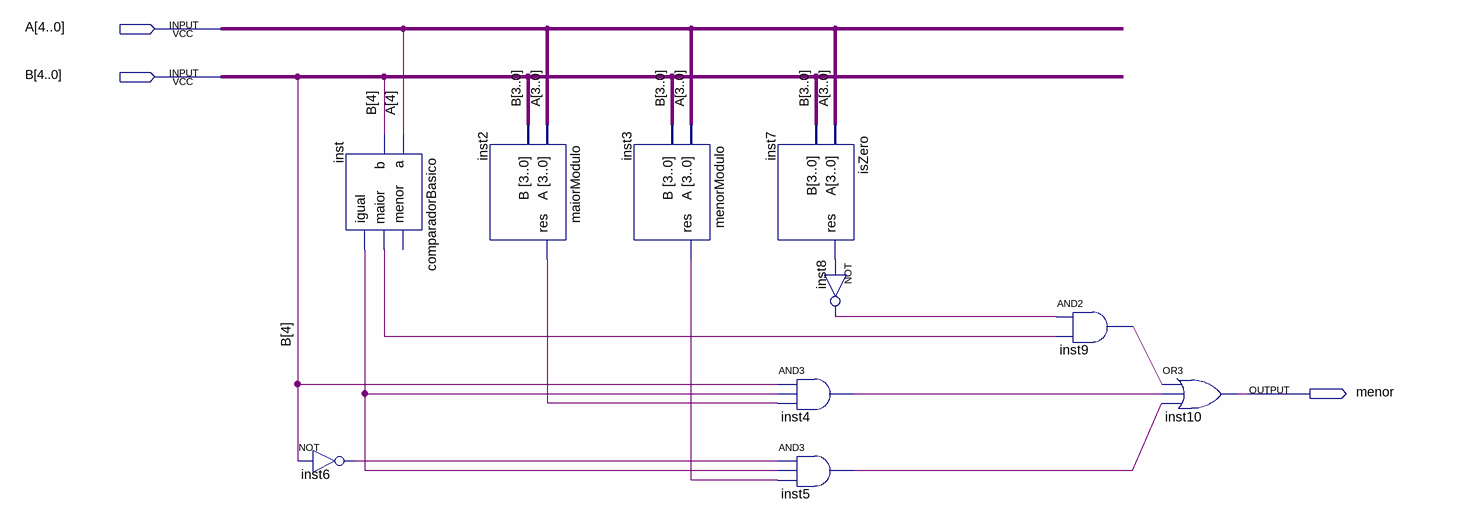
[diagram p0: schematic sheet]
// Quartus schematic menor.bdf as structural Verilog: 10 symbols, 3 pins
module menor (
  input  [4:0] A,
  input  [4:0] B,
  output menor
);

  wire inst2_res, inst3_res, inst4_out, inst5_out, inst6_out, inst7_res, inst8_out, inst9_out, inst_igual,
       inst_maior;

  not inst6 (inst6_out, B[4]);
  comparadorBasico inst (.a(A[4]), .b(B[4]), .maior(inst_maior), .igual(inst_igual));  // open: menor
  maiorModulo inst2 (.A(A[3:0]), .B(B[3:0]), .res(inst2_res));
  menorModulo inst3 (.A(A[3:0]), .B(B[3:0]), .res(inst3_res));
  isZero inst7 (.A(A[3:0]), .B(B[3:0]), .res(inst7_res));
  not inst8 (inst8_out, inst7_res);
  and inst4 (inst4_out, B[4], inst_igual, inst2_res);
  and inst5 (inst5_out, inst6_out, inst_igual, inst3_res);
  and inst9 (inst9_out, inst8_out, inst_maior);
  or inst10 (menor, inst9_out, inst4_out, inst5_out);
endmodule
